# Altium schematic sheet ZYNQ 34_35 and QPSI.SchDoc
size A3; SheetNumber: 5; SheetTotal: 14
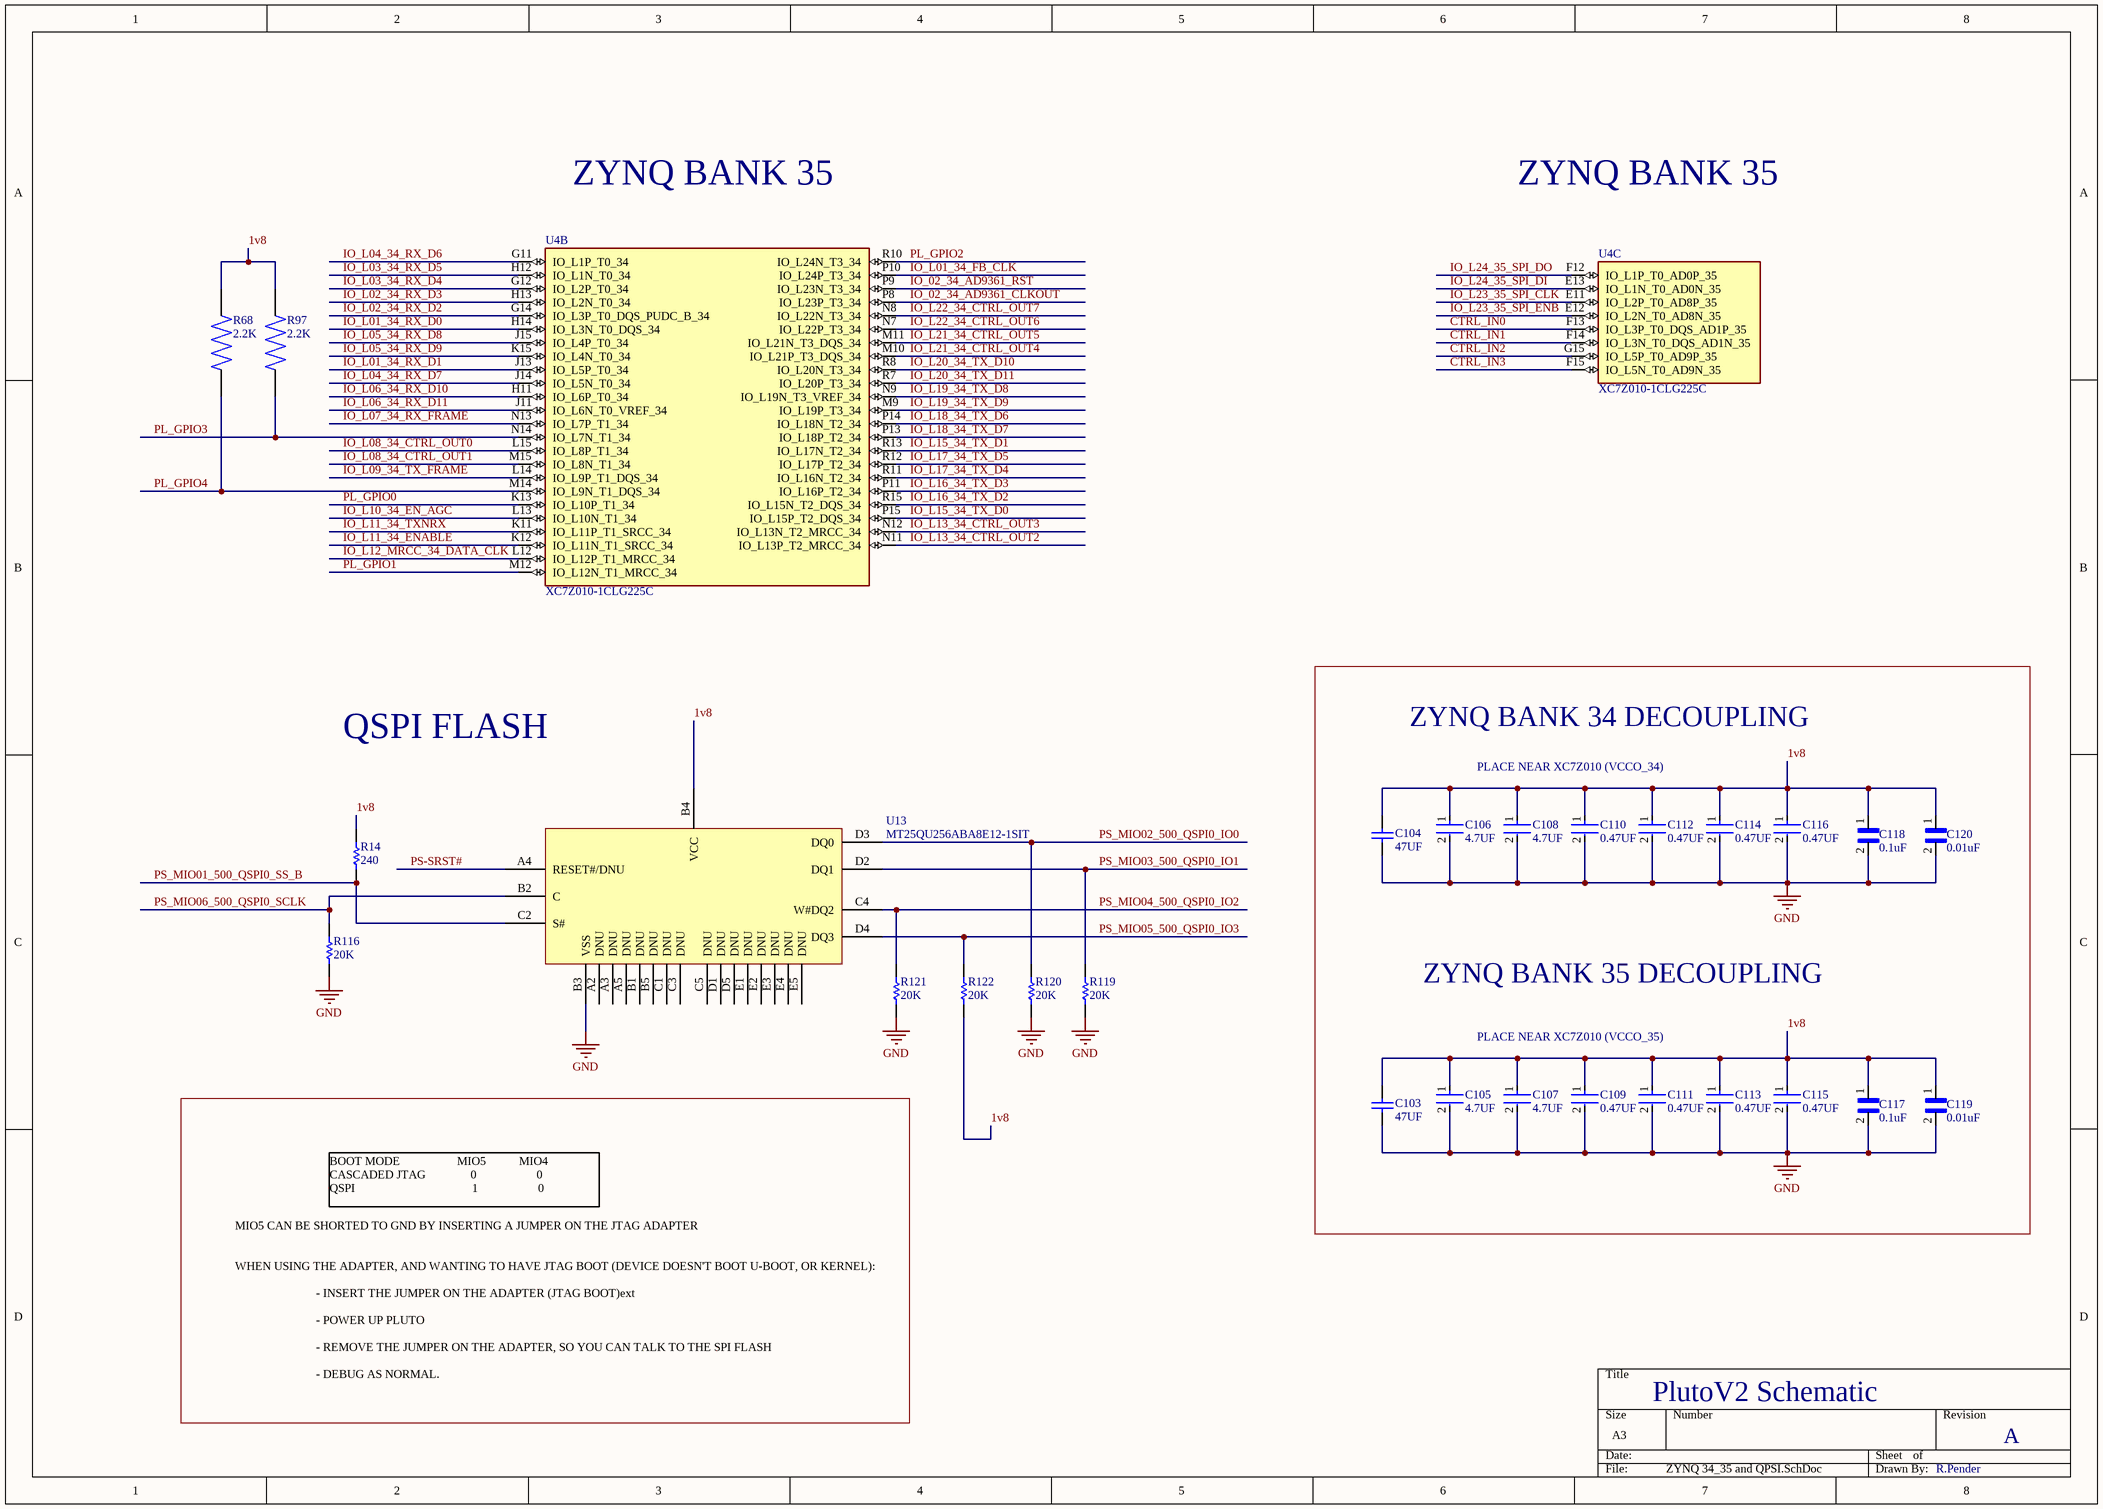
[diagram p0: ZYNQ 34_35 and QPSI.SchDoc]

## Parts
C103  47UF  [TAYO-JMK212BBJ476MG-T_L]
C104  47UF  [TAYO-JMK212BBJ476MG-T_L]
C105  4.7UF  [FP-C1005-050-0_15-MFG]
C106  4.7UF  [FP-C1005-050-0_15-MFG]
C107  4.7UF  [FP-C1005-050-0_15-MFG]
C108  4.7UF  [FP-C1005-050-0_15-MFG]
C109  0.47UF  [FP-C1005-050-0_15-MFG]
C110  0.47UF  [FP-C1005-050-0_15-MFG]
C111  0.47UF  [FP-C1005-050-0_15-MFG]
C112  0.47UF  [FP-C1005-050-0_15-MFG]
C113  0.47UF  [FP-C1005-050-0_15-MFG]
C114  0.47UF  [FP-C1005-050-0_15-MFG]
C115  0.47UF  [FP-C1005-050-0_15-MFG]
C116  0.47UF  [FP-C1005-050-0_15-MFG]
C117  0.1uF  [CAPC0603X33N]
C118  0.1uF  [CAPC0603X33N]
C119  0.01uF  [CAPC0603X33N]
C120  0.01uF  [CAPC0603X33N]
R14  240  [2-0402]
R68  2.2K  [RESC1005X35N]
R97  2.2K  [RESC1005X35N]
R116  20K  [2-0402]
R119  20K  [2-0402]
R120  20K  [2-0402]
R121  20K  [2-0402]
R122  20K  [2-0402]
U4  XC7Z010-1CLG225C  [BGA225C80P15X15_1300X1300X150]  (parts B,C of 6)
U13  MT25QU256ABA8E12-1SIT  [BGA25C100P5X5_800X600X120N]

## Nets
GND: C103.2 C104.2 C105.2 C106.2 C107.2 C108.2 C109.2 C110.2 C111.2 C112.2 C113.2 C114.2 C115.2 C116.2 C117.2 C118.2 C119.2 C120.2 R116.2 R119.2 R120.2 R121.2 U13.B3(VSS)
1v8: C103.1 C104.1 C105.1 C106.1 C107.1 C108.1 C109.1 C110.1 C111.1 C112.1 C113.1 C114.1 C115.1 C116.1 C117.1 C118.1 C119.1 C120.1 R14.1 R68.2 R97.2 R122.2 U13.B4(VCC)
CTRL_IN0: U4.F13(IO_L3P_T0_DQS_AD1P_35)
CTRL_IN1: U4.F14(IO_L3N_T0_DQS_AD1N_35)
CTRL_IN2: U4.G15(IO_L5P_T0_AD9P_35)
CTRL_IN3: U4.F15(IO_L5N_T0_AD9N_35)
IO_02_34_AD9361_CLKOUT: U4.P8(IO_L23P_T3_34)
IO_02_34_AD9361_RST: U4.P9(IO_L23N_T3_34)
IO_L01_34_FB_CLK: U4.P10(IO_L24P_T3_34)
IO_L01_34_RX_D0: U4.H14(IO_L3N_T0_DQS_34)
IO_L01_34_RX_D1: U4.J13(IO_L5P_T0_34)
IO_L02_34_RX_D2: U4.G14(IO_L3P_T0_DQS_PUDC_B_34)
IO_L02_34_RX_D3: U4.H13(IO_L2N_T0_34)
IO_L03_34_RX_D4: U4.G12(IO_L2P_T0_34)
IO_L03_34_RX_D5: U4.H12(IO_L1N_T0_34)
IO_L04_34_RX_D6: U4.G11(IO_L1P_T0_34)
IO_L04_34_RX_D7: U4.J14(IO_L5N_T0_34)
IO_L05_34_RX_D8: U4.J15(IO_L4P_T0_34)
IO_L05_34_RX_D9: U4.K15(IO_L4N_T0_34)
IO_L06_34_RX_D10: U4.H11(IO_L6P_T0_34)
IO_L06_34_RX_D11: U4.J11(IO_L6N_T0_VREF_34)
IO_L07_34_RX_FRAME: U4.N13(IO_L7P_T1_34)
IO_L08_34_CTRL_OUT0: U4.L15(IO_L8P_T1_34)
IO_L08_34_CTRL_OUT1: U4.M15(IO_L8N_T1_34)
IO_L09_34_TX_FRAME: U4.L14(IO_L9P_T1_DQS_34)
IO_L10_34_EN_AGC: U4.L13(IO_L10N_T1_34)
IO_L11_34_ENABLE: U4.K12(IO_L11N_T1_SRCC_34)
IO_L11_34_TXNRX: U4.K11(IO_L11P_T1_SRCC_34)
IO_L12_MRCC_34_DATA_CLK: U4.L12(IO_L12P_T1_MRCC_34)
IO_L13_34_CTRL_OUT2: U4.N11(IO_L13P_T2_MRCC_34)
IO_L13_34_CTRL_OUT3: U4.N12(IO_L13N_T2_MRCC_34)
IO_L15_34_TX_D0: U4.P15(IO_L15P_T2_DQS_34)
IO_L15_34_TX_D1: U4.R13(IO_L17N_T2_34)
IO_L16_34_TX_D2: U4.R15(IO_L15N_T2_DQS_34)
IO_L16_34_TX_D3: U4.P11(IO_L16P_T2_34)
IO_L17_34_TX_D4: U4.R11(IO_L16N_T2_34)
IO_L17_34_TX_D5: U4.R12(IO_L17P_T2_34)
IO_L18_34_TX_D6: U4.P14(IO_L18N_T2_34)
IO_L18_34_TX_D7: U4.P13(IO_L18P_T2_34)
IO_L19_34_TX_D8: U4.N9(IO_L19N_T3_VREF_34)
IO_L19_34_TX_D9: U4.M9(IO_L19P_T3_34)
IO_L20_34_TX_D10: U4.R8(IO_L20N_T3_34)
IO_L20_34_TX_D11: U4.R7(IO_L20P_T3_34)
IO_L21_34_CTRL_OUT4: U4.M10(IO_L21P_T3_DQS_34)
IO_L21_34_CTRL_OUT5: U4.M11(IO_L21N_T3_DQS_34)
IO_L22_34_CTRL_OUT6: U4.N7(IO_L22P_T3_34)
IO_L22_34_CTRL_OUT7: U4.N8(IO_L22N_T3_34)
IO_L23_35_SPI_CLK: U4.E11(IO_L2P_T0_AD8P_35)
IO_L23_35_SPI_ENB: U4.E12(IO_L2N_T0_AD8N_35)
IO_L24_35_SPI_DI: U4.E13(IO_L1N_T0_AD0N_35)
IO_L24_35_SPI_DO: U4.F12(IO_L1P_T0_AD0P_35)
PL_GPIO0: U4.K13(IO_L10P_T1_34)
PL_GPIO1: U4.M12(IO_L12N_T1_MRCC_34)
PL_GPIO2: U4.R10(IO_L24N_T3_34)
PL_GPIO3: R97.1 U4.N14(IO_L7N_T1_34)
PL_GPIO4: R68.1 U4.M14(IO_L9N_T1_DQS_34)
PS-SRST#: U13.A4(RESET#/DNU)
PS_MIO01_500_QSPI0_SS_B: R14.2 U13.C2(S#)
PS_MIO02_500_QSPI0_IO0: R120.1 U13.D3(DQ0)
PS_MIO03_500_QSPI0_IO1: R119.1 U13.D2(DQ1)
PS_MIO04_500_QSPI0_IO2: R121.1 U13.C4(W#DQ2)
PS_MIO05_500_QSPI0_IO3: R122.1 U13.D4(DQ3)
PS_MIO06_500_QSPI0_SCLK: R116.1 U13.B2(C)

Not connected (* = marked no-connect by the designer): U13 A2(DNU) A3(DNU) A5(DNU) B1(DNU) B5(DNU) C1(DNU) C3(DNU) C5(DNU) D1(DNU) D5(DNU) E1(DNU) E2(DNU) E3(DNU) E4(DNU) E5(DNU)

## Notes on the sheet
- ZYNQ BANK 35
- QSPI FLASH
- ZYNQ BANK 34 DECOUPLING
- PLACE NEAR XC7Z010 (VCCO_34)
- ZYNQ BANK 35 DECOUPLING
- PLACE NEAR XC7Z010 (VCCO_35)
- MIO5 CAN BE SHORTED TO GND BY INSERTING A JUMPER ON THE JTAG ADAPTER
- BOOT MODE                   MIO5           MIO4                      CASCADED JTAG               0                    0                                              QSPI                                       1                    0
- WHEN USING THE ADAPTER, AND WANTING TO HAVE JTAG BOOT (DEVICE DOESN'T BOOT U-BOOT, OR KERNEL):
- - INSERT THE JUMPER ON THE ADAPTER (JTAG BOOT)ext
- - POWER UP PLUTO
- - REMOVE THE JUMPER ON THE ADAPTER, SO YOU CAN TALK TO THE SPI FLASH
- - DEBUG AS NORMAL.
- PlutoV2 Schematic
- A
- R.Pender

## Library data of the parts
C103 C104 = CMP-2000-06498-1: High Value Multilayer Ceramic Capacitor, 47 uF, +/-20%, 6.3 V, -55 to 85 degC, 2-Pin SMD (0805), RoHS, Tape and Reel; Manufacturer: Taiyo Yuden; PCN Part Number: X5R,X7RDielectrics23/Jan/2008; Kits: 587-1797-KIT-ND-KITCAPCERHICAP0603&0805S; Temperature Coefficient: X5R; Tolerance: ±20%; Online Catalog: MSeries; Other Names: 587-1779-1; Capacitance: 47µF; Voltage - Rated: 6.3V; Catalog Drawings: xMKSeries_0805_1.25; Operating Temperature: -55°C~85°C; Mounting Technology: SurfaceMount; Package Reference: 0805; Features: -; Lead Spacing: -; Lead Style: -; Family: CeramicCapacitors; Size / Dimension: 0.079"Lx0.049"W(2.00mmx1.25mm); Package Description: 2-Pin SMD, Body 2.2 x 1.45 mm; Mounting Type: SurfaceMount,MLCC; Package / Case: 0805(2012Metric); Series: M; Category: Capacitors; Packaging: CutTape(CT); Datasheet Version: 10/2015; Datasheet URL: http://datasheet.octopart.com/JMK212BJ476MG-T-Taiyo-Yuden-datasheet-62109412.pdf; Manufacturer URL: http://www.t-yuden.com/; Ratings: -; Height - Seated (Max): -; Standard Package: 1; Thickness (Max): 0.053"(1.35mm); Applications: GeneralPurpose
C105-C116 = CMP-2000-05437-2: CAP CER 4.7UF 6.3V X5R 0402; Tolerance: 10%; Dielectric Material: Ceramic; Voltage: 6.3V; Capacitance: 4.7uF; Depth: 0.5mm; Height: 0.5mm; Length: 1mm; Termination: SMD/SMT; RoHS Compliant: Yes; Series: C; Case/Package: 0402; Dielectric: X5R; Lead Free: Lead Free; Mount: Surface Mount; Max Operating Temperature: 85°C; Min Operating Temperature: -55°C
C117 C118 = GRM033R61C104ME84D: CAP 0.1UF 16VDC X5R 20% SMD 0201 PAPER TAPE; Package: None; Price: None; Value: *; MP: GRM033R61C104ME84D; Availability: Unavailable
C119 C120 = GRM033R71A103KA01D: SMD Capacitor X7R(EIA) with Capacitance: 10000pF Tol. 10%. Rated Voltage: 10Vdc; MF: Murata; Package: 0603 Taiyo Yuden; MP: GRM033R71A103KA01D; Value: *; SnapEDA_Link: https://www.snapeda.com/parts/GRM033R71A103KA01D/Murata/view-part/4379446/?ref=snap; Availability: Unavailable; Price: None; Check_prices: https://www.snapeda.com/parts/GRM033R71A103KA01D/Murata/view-part/4379446/?ref=eda
R14 R116 R119-R122 = ERJ2RK: Precision Thick Film Chip Resistor, 10 Ohm to 1M Ohm Range, 1% and 0.5% Tolerance, 0402 Size, 0.063 W; Published: 17-Dec-2003; LatestRevisionDate: 19-Mar-2004; LatestRevisionNote: Silkscreen size reduced.; PackageDocument: Mar-2003; PackageReference: 2-0402; Publisher: Altium Limited; Code_IPC: 1005 [0402]; ComponentLink1Description: Manufacturer Link; ComponentLink1URL: http://www.panasonic.com/industrial/components/resistive_products.htm; ComponentLink2Description: Datasheet; ComponentLink2URL: http://www.panasonic.com/industrial/components/pdf/AOA0000CE2.pdf
R68 R97 = CRCW04022K20FKEDC: 2.2 kOhms Â±1% 0.063W, 1/16W Chip Resistor 0402 _1005 Metric_ Thick Film; MF: Vishay; Price: None; Package: 1005 Yageo; Availability: Unavailable; SnapEDA_Link: https://www.snapeda.com/parts/CRCW04022K20FKEDC/Vishay/view-part/4129871/?ref=snap; Value: *; MP: CRCW04022K20FKEDC
U4 = XC7Z010-1CLG225C: Dual ARMÂ® CortexÂ®-A9 MPCoreâ„¢ with CoreSightâ„¢ System On Chip _SOC_ IC ZynqÂ®-7000 Artixâ„¢-7 FPGA, 28K Logic Cells 667MHz 225-CSPBGA _13x13_; MF: Xilinx Inc.; Value: *; SnapEDA_Link: https://www.snapeda.com/parts/XC7Z010-1CLG225C/Xilinx%20Inc./view-part/45778/?ref=snap; Digi-Key_Part_Number: 122-1855-ND; Package: CSPBGA-225 Xilinx; Digi-Key_Purchase_URL: https://www.digikey.by/product-detail/en/xilinx-inc/XC7Z010-1CLG225C/122-1855-ND/3925788?utm_source=snapeda&utm_medium=aggregator&utm_campaign=symbol; MP: XC7Z010-1CLG225C
U13 = Component_1